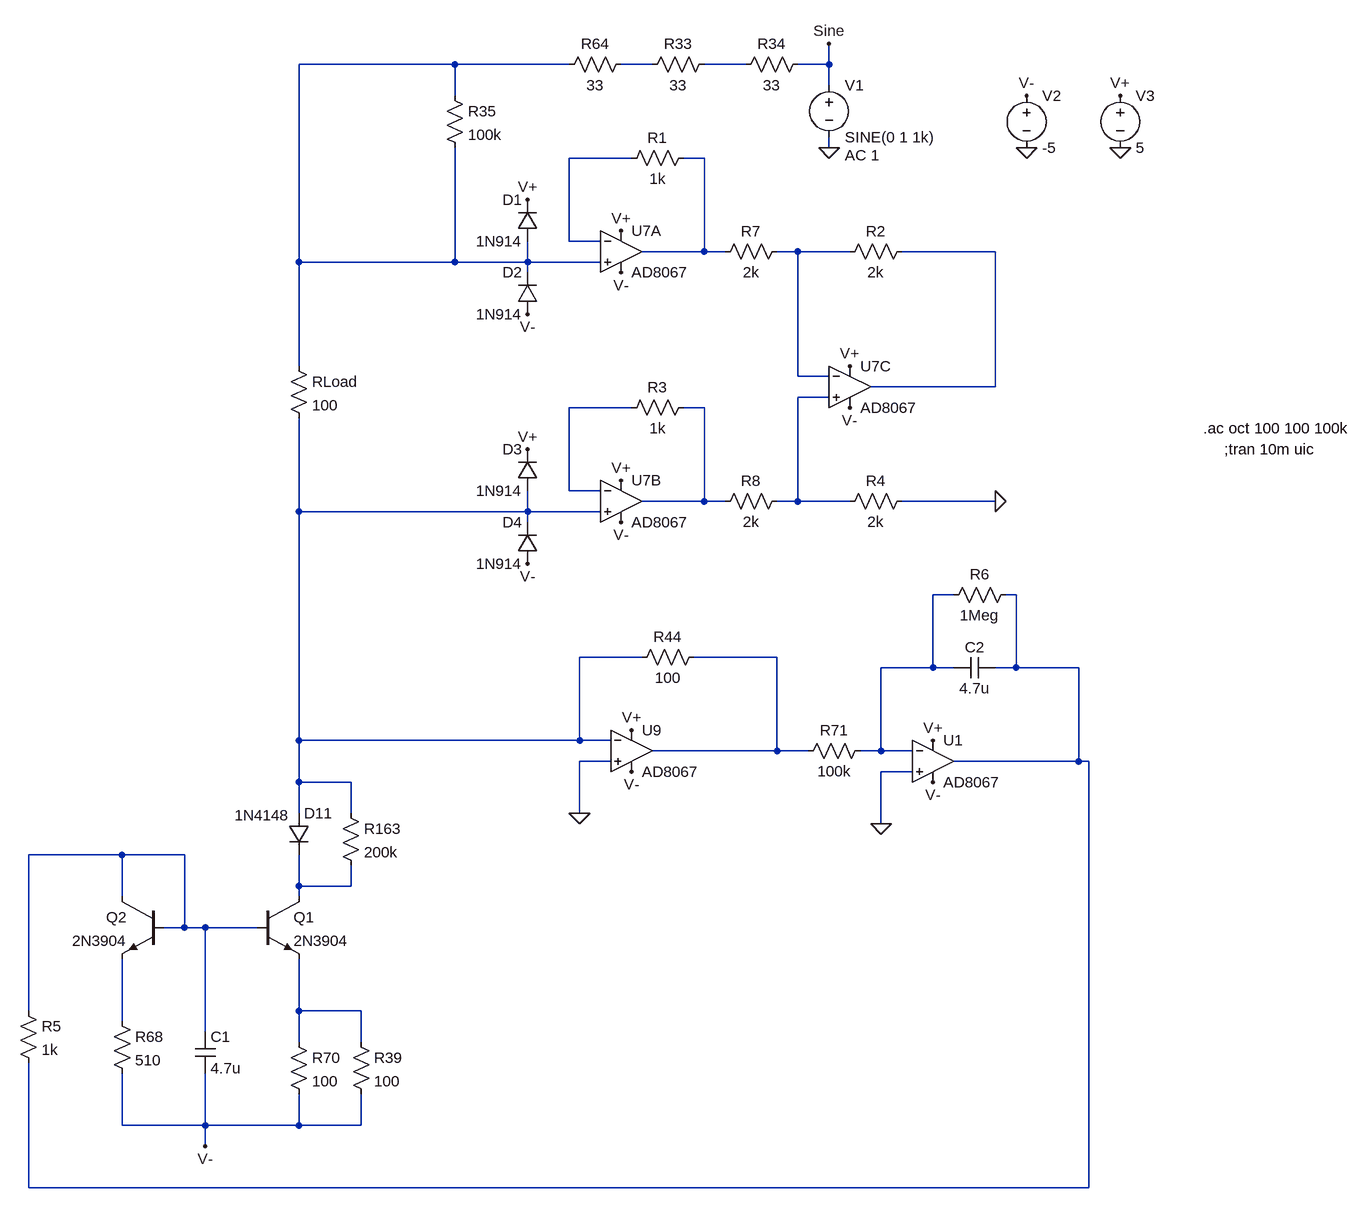
[diagram p0: schematic Elector_LCR.asc]
Elector_LCR.asc, the LTspice schematic file:
Version 4
SHEET 1 1016 1816
WIRE -416 80 -656 80
WIRE -240 80 -416 80
WIRE -112 80 -160 80
WIRE 32 80 -32 80
WIRE 160 80 160 48
WIRE 160 80 112 80
WIRE 160 112 160 80
WIRE -416 128 -416 80
WIRE 160 208 160 192
WIRE -144 224 -240 224
WIRE -32 224 -64 224
WIRE -240 352 -240 224
WIRE -192 352 -240 352
WIRE -32 368 -32 224
WIRE -32 368 -128 368
WIRE 0 368 -32 368
WIRE 112 368 80 368
WIRE 192 368 112 368
WIRE 416 368 272 368
WIRE -656 384 -656 80
WIRE -416 384 -416 208
WIRE -416 384 -656 384
WIRE -304 384 -304 352
WIRE -304 384 -416 384
WIRE -192 384 -304 384
WIRE -304 400 -304 384
WIRE -656 544 -656 384
WIRE 112 560 112 368
WIRE 160 560 112 560
WIRE 416 576 416 368
WIRE 416 576 224 576
WIRE 160 592 112 592
WIRE -144 608 -240 608
WIRE -32 608 -64 608
WIRE -240 736 -240 608
WIRE -192 736 -240 736
WIRE -32 752 -32 608
WIRE -32 752 -128 752
WIRE 0 752 -32 752
WIRE 112 752 112 592
WIRE 112 752 80 752
WIRE 192 752 112 752
WIRE 416 752 272 752
WIRE -656 768 -656 624
WIRE -304 768 -304 736
WIRE -304 768 -656 768
WIRE -192 768 -304 768
WIRE -304 784 -304 768
WIRE 352 896 320 896
WIRE 448 896 432 896
WIRE -128 992 -224 992
WIRE 80 992 -48 992
WIRE 320 1008 320 896
WIRE 320 1008 240 1008
WIRE 352 1008 320 1008
WIRE 448 1008 448 896
WIRE 448 1008 416 1008
WIRE 544 1008 448 1008
WIRE -656 1120 -656 768
WIRE -224 1120 -224 992
WIRE -224 1120 -656 1120
WIRE -176 1120 -224 1120
WIRE 80 1136 80 992
WIRE 80 1136 -112 1136
WIRE 128 1136 80 1136
WIRE 240 1136 240 1008
WIRE 240 1136 208 1136
WIRE 288 1136 240 1136
WIRE -176 1152 -224 1152
WIRE 544 1152 544 1008
WIRE 544 1152 352 1152
WIRE 560 1152 544 1152
WIRE 288 1168 240 1168
WIRE -656 1184 -656 1120
WIRE -576 1184 -656 1184
WIRE -656 1232 -656 1184
WIRE -576 1232 -576 1184
WIRE -224 1232 -224 1152
WIRE 240 1248 240 1168
WIRE -928 1296 -1072 1296
WIRE -832 1296 -928 1296
WIRE -656 1344 -656 1296
WIRE -576 1344 -576 1312
WIRE -576 1344 -656 1344
WIRE -928 1360 -928 1296
WIRE -656 1360 -656 1344
WIRE -832 1408 -832 1296
WIRE -832 1408 -864 1408
WIRE -800 1408 -832 1408
WIRE -720 1408 -800 1408
WIRE -1072 1536 -1072 1296
WIRE -656 1536 -656 1456
WIRE -560 1536 -656 1536
WIRE -928 1552 -928 1456
WIRE -800 1568 -800 1408
WIRE -656 1584 -656 1536
WIRE -560 1584 -560 1536
WIRE -928 1712 -928 1632
WIRE -800 1712 -800 1632
WIRE -800 1712 -928 1712
WIRE -656 1712 -656 1664
WIRE -656 1712 -800 1712
WIRE -560 1712 -560 1664
WIRE -560 1712 -656 1712
WIRE -800 1744 -800 1712
WIRE -1072 1808 -1072 1616
WIRE 560 1808 560 1152
WIRE 560 1808 -1072 1808
FLAG 160 48 Sine
FLAG 160 208 0
FLAG 464 208 0
FLAG 608 208 0
FLAG 608 128 V+
FLAG 464 128 V-
FLAG -160 336 V+
FLAG -304 288 V+
FLAG -160 400 V-
FLAG -304 464 V-
FLAG 192 544 V+
FLAG 192 608 V-
FLAG -160 720 V+
FLAG -304 672 V+
FLAG -160 784 V-
FLAG -304 848 V-
FLAG -144 1104 V+
FLAG -144 1168 V-
FLAG -224 1232 0
FLAG 320 1120 V+
FLAG 320 1184 V-
FLAG 240 1248 0
FLAG -800 1744 V-
FLAG 416 752 0
SYMBOL voltage 160 96 R0
WINDOW 123 24 124 Left 2
WINDOW 39 0 0 Left 0
SYMATTR InstName V1
SYMATTR Value SINE(0 1 1k)
SYMATTR Value2 AC 1
SYMBOL res 128 64 R90
WINDOW 0 0 56 VBottom 2
WINDOW 3 32 56 VTop 2
SYMATTR InstName R34
SYMATTR Value 33
SYMBOL res -16 64 R90
WINDOW 0 0 56 VBottom 2
WINDOW 3 32 56 VTop 2
SYMATTR InstName R33
SYMATTR Value 33
SYMBOL res -144 64 R90
WINDOW 0 0 56 VBottom 2
WINDOW 3 32 56 VTop 2
SYMATTR InstName R64
SYMATTR Value 33
SYMBOL res -432 112 R0
SYMATTR InstName R35
SYMATTR Value 100k
SYMBOL res -672 528 R0
SYMATTR InstName RLoad
SYMATTR Value 100
SYMBOL OpAmps\\AD8067 -160 304 R0
SYMATTR InstName U7A
SYMBOL diode -288 352 R180
WINDOW 0 24 64 Left 2
WINDOW 3 24 0 Left 2
SYMATTR InstName D1
SYMATTR Value 1N914
SYMBOL diode -288 464 R180
WINDOW 0 24 64 Left 2
WINDOW 3 24 0 Left 2
SYMATTR InstName D2
SYMATTR Value 1N914
SYMBOL voltage 464 112 R0
WINDOW 123 0 0 Left 0
WINDOW 39 0 0 Left 0
SYMATTR InstName V2
SYMATTR Value -5
SYMBOL voltage 608 112 R0
WINDOW 123 0 0 Left 0
WINDOW 39 0 0 Left 0
SYMATTR InstName V3
SYMATTR Value 5
SYMBOL res -48 208 R90
WINDOW 0 0 56 VBottom 2
WINDOW 3 32 56 VTop 2
SYMATTR InstName R1
SYMATTR Value 1k
SYMATTR SpiceLine tol=1
SYMBOL OpAmps\\AD8067 192 512 R0
SYMATTR InstName U7C
SYMBOL res 288 352 R90
WINDOW 0 0 56 VBottom 2
WINDOW 3 32 56 VTop 2
SYMATTR InstName R2
SYMATTR Value 2k
SYMBOL OpAmps\\AD8067 -160 688 R0
SYMATTR InstName U7B
SYMBOL diode -288 736 R180
WINDOW 0 24 64 Left 2
WINDOW 3 24 0 Left 2
SYMATTR InstName D3
SYMATTR Value 1N914
SYMBOL diode -288 848 R180
WINDOW 0 24 64 Left 2
WINDOW 3 24 0 Left 2
SYMATTR InstName D4
SYMATTR Value 1N914
SYMBOL res -48 592 R90
WINDOW 0 0 56 VBottom 2
WINDOW 3 32 56 VTop 2
SYMATTR InstName R3
SYMATTR Value 1k
SYMATTR SpiceLine tol=1
SYMBOL res 288 736 R90
WINDOW 0 0 56 VBottom 2
WINDOW 3 32 56 VTop 2
SYMATTR InstName R4
SYMATTR Value 2k
SYMBOL OpAmps\\AD8067 -144 1072 R0
SYMATTR InstName U9
SYMBOL res -32 976 R90
WINDOW 0 0 56 VBottom 2
WINDOW 3 32 56 VTop 2
SYMATTR InstName R44
SYMATTR Value 100
SYMATTR SpiceLine tol=1
SYMBOL OpAmps\\AD8067 320 1088 R0
SYMATTR InstName U1
SYMBOL res 224 1120 R90
WINDOW 0 0 56 VBottom 2
WINDOW 3 32 56 VTop 2
SYMATTR InstName R71
SYMATTR Value 100k
SYMBOL npn -720 1360 R0
SYMATTR InstName Q1
SYMATTR Value 2N3904
SYMBOL npn -864 1360 M0
SYMATTR InstName Q2
SYMATTR Value 2N3904
SYMBOL cap -816 1568 R0
SYMATTR InstName C1
SYMATTR Value 4.7u
SYMBOL res -672 1568 R0
SYMATTR InstName R70
SYMATTR Value 100
SYMBOL res -576 1568 R0
SYMATTR InstName R39
SYMATTR Value 100
SYMBOL res -944 1536 R0
SYMATTR InstName R68
SYMATTR Value 510
SYMBOL res -1088 1520 R0
SYMATTR InstName R5
SYMATTR Value 1k
SYMBOL res 448 880 R90
WINDOW 0 0 56 VBottom 2
WINDOW 3 32 56 VTop 2
SYMATTR InstName R6
SYMATTR Value 1Meg
SYMBOL diode -672 1232 R0
WINDOW 3 -83 3 Left 2
SYMATTR InstName D11
SYMATTR Value 1N4148
SYMBOL res -592 1216 R0
SYMATTR InstName R163
SYMATTR Value 200k
SYMBOL res 96 352 R90
WINDOW 0 0 56 VBottom 2
WINDOW 3 32 56 VTop 2
SYMATTR InstName R7
SYMATTR Value 2k
SYMBOL res 96 736 R90
WINDOW 0 0 56 VBottom 2
WINDOW 3 32 56 VTop 2
SYMATTR InstName R8
SYMATTR Value 2k
SYMBOL cap 416 992 R90
WINDOW 0 0 32 VBottom 2
WINDOW 3 32 32 VTop 2
SYMATTR InstName C2
SYMATTR Value 4.7u
TEXT 736 640 Left 2 !.ac oct 100 100 100k
TEXT 768 672 Left 2 !;tran 10m uic

The netlist it stands for:
* Elector_LCR.asc
V1 Sine 0 SINE(0 1 1k) AC 1
R34 Sine N003 33
R33 N003 N002 33
R64 N002 N001 33
R35 N001 N001 100k
RLoad N001 N011 100
XU7A N001 N004 V+ V- N005 AD8067  ; pins In+ In- V+ V- OUT
D1 N001 V+ 1N914
D2 V- N001 1N914
V2 V- 0 -5
V3 V+ 0 5
R1 N005 N004 1k tol=1
XU7C N008 N006 V+ V- N007 AD8067  ; pins In+ In- V+ V- OUT
R2 N007 N006 2k
XU7B N011 N009 V+ V- N010 AD8067  ; pins In+ In- V+ V- OUT
D3 N011 V+ 1N914
D4 V- N011 1N914
R3 N010 N009 1k tol=1
R4 0 N008 2k
XU9 0 N011 V+ V- N014 AD8067  ; pins In+ In- V+ V- OUT
R44 N014 N011 100 tol=1
XU1 0 N012 V+ V- N013 AD8067  ; pins In+ In- V+ V- OUT
R71 N012 N014 100k
Q1 N016 N015 N017 0 2N3904
Q2 N015 N015 N018 0 2N3904
C1 N015 V- 4.7u
R70 N017 V- 100
R39 N017 V- 100
R68 N018 V- 510
R5 N015 N013 1k
R6 N013 N012 1Meg
D11 N011 N016 1N4148
R163 N011 N016 200k
R7 N006 N005 2k
R8 N008 N010 2k
C2 N013 N012 4.7u
.model D D
.lib standard.dio
.model NPN NPN
.model PNP PNP
.lib standard.bjt
.ac oct 100 100 100k
;tran 10m uic
.backanno
.end